# Altium project ME507_STM32_PCB.PrjPcb
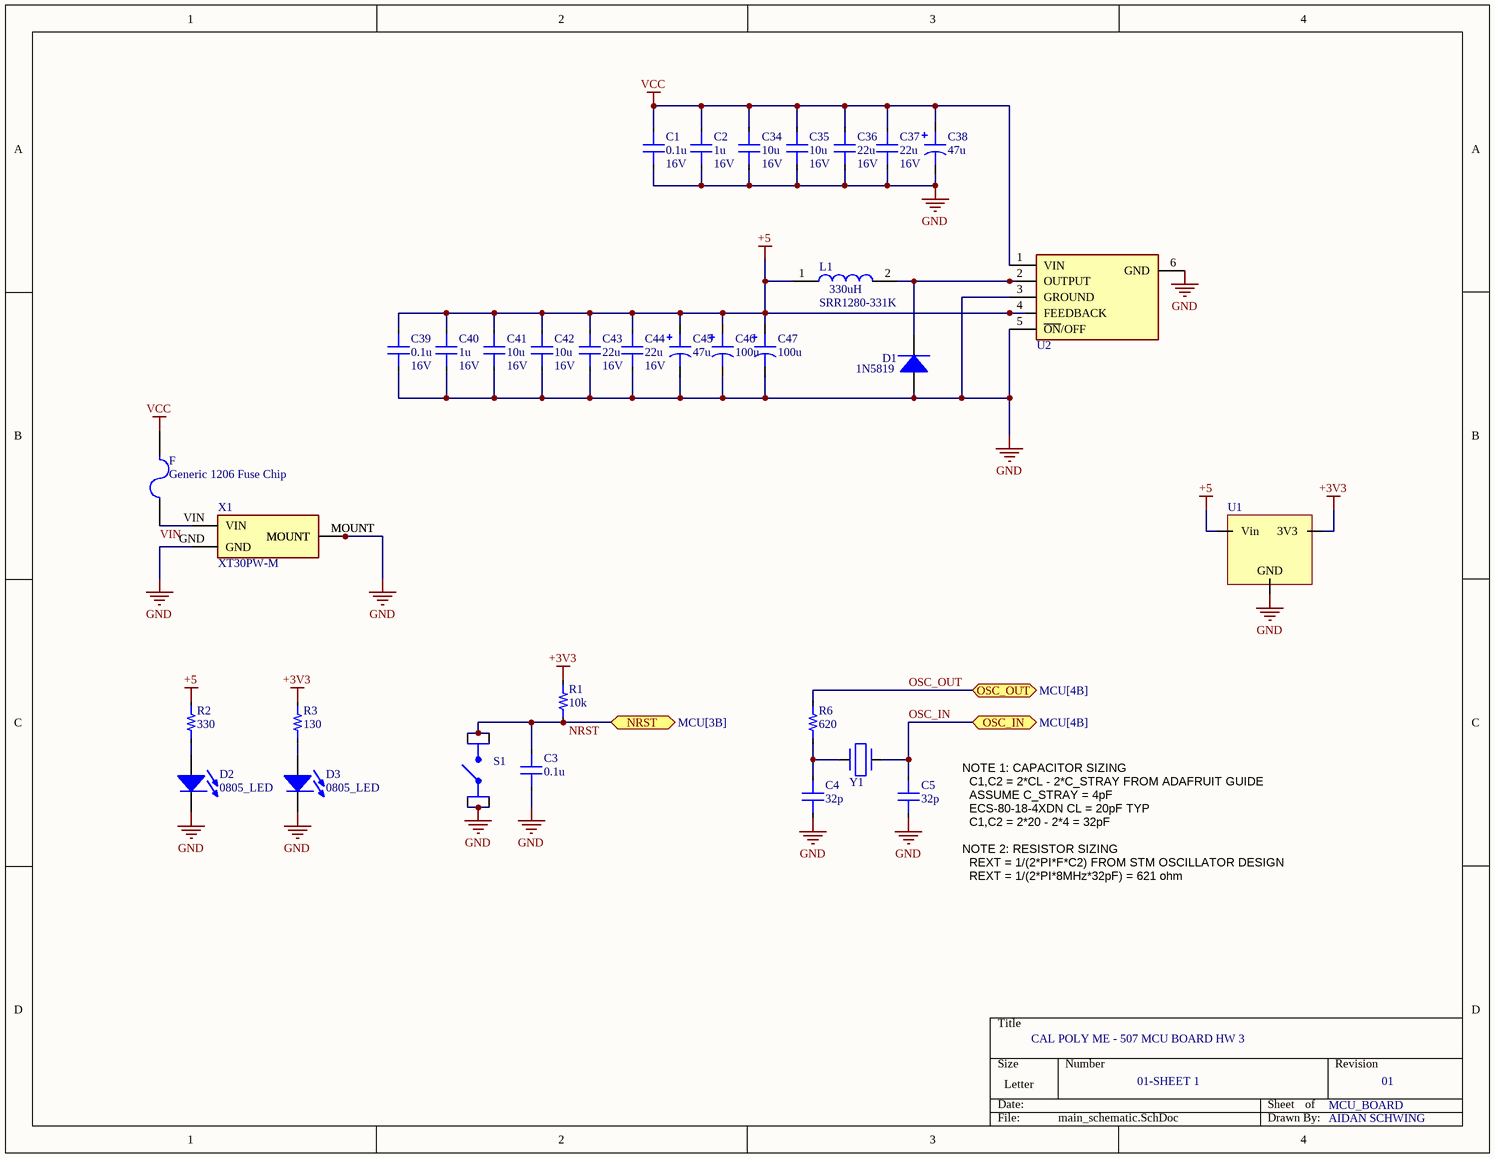
[diagram p0: main_schematic.SchDoc]
2 sheets, 73 parts. Net scope: flat (ports and power ports of the same name join across sheets).
Board file: MCU_v2.PcbDoc
Sheets:
  main_schematic.SchDoc
  MCU.SchDoc

## Sheet main_schematic.SchDoc
size Letter; DrawnBy: AIDAN SCHWING; SheetNumber: 1; SheetTotal: 2

### Parts
C1  value 0.1u  Voltage: 16V  [0603_CAP]  (hidden comment: Capacitor)
C2  value 1u  Voltage: 16V  [0603_CAP]  (hidden comment: Capacitor)
C3  value 0.1u  [0805_CAP]  (hidden comment: Capacitor)
C4  value 32p  [0805_CAP]  (hidden comment: Capacitor)
C5  value 32p  [0805_CAP]  (hidden comment: Capacitor)
C34  value 10u  Voltage: 16V  [0805_CAP]  (hidden comment: Capacitor)
C35  value 10u  Voltage: 16V  [0805_CAP]  (hidden comment: Capacitor)
C36  value 22u  Voltage: 16V  [1210_CAP]  (hidden comment: Capacitor)
C37  value 22u  Voltage: 16V  [1210_CAP]  (hidden comment: Capacitor)
C38  value 47u  [6.60x6.60x8.00mm_E_CAP]  (hidden comment: UWT1H470MCL1GS)
C39  value 0.1u  Voltage: 16V  [0603_CAP]  (hidden comment: Capacitor)
C40  value 1u  Voltage: 16V  [0603_CAP]  (hidden comment: Capacitor)
C41  value 10u  Voltage: 16V  [0805_CAP]  (hidden comment: Capacitor)
C42  value 10u  Voltage: 16V  [0805_CAP]  (hidden comment: Capacitor)
C43  value 22u  Voltage: 16V  [1210_CAP]  (hidden comment: Capacitor)
C44  value 22u  Voltage: 16V  [1210_CAP]  (hidden comment: Capacitor)
C45  value 47u  [6.60x6.60x8.00mm_E_CAP]  (hidden comment: UWT1H470MCL1GS)
C46  value 100u  [6.60x6.60x8.00mm_E_CAP]  (hidden comment: 865080343009)
C47  value 100u  [6.60x6.60x8.00mm_E_CAP]  (hidden comment: 865080343009)
D1  1N5819  [SOD-123F]
D2  0805_LED  [0805_LED]
D3  0805_LED  [0805_LED]
F  Generic 1206 Fuse Chip  [1206_RES]
L1  SRR1280-331K  [SRR1280-150M]
R1  value 10k  [0603_RES]  (hidden comment: Resistor)
R2  value 330  [0603_RES]  (hidden comment: Resistor)
R3  value 130  [0603_RES]  (hidden comment: Resistor)
R6  value 620  [0805_RES]  (hidden comment: Resistor)
S1  TactileSwitch  [6mmTactileSwitch_ThroughHole]  (value not drawn)
U1  (no value)  [DPAK3_TO-252-3]
U2  LM2576-5.0WU  [MICROCHIP_TO-263]  (value not drawn)
X1  XT30PW-M  [XT30PWM]
Y1  ECS-80-18-4XDN  [ECS-80-18]  (value not drawn)

### Ports
NRST (bidir, see MCU[3B]), OSC_IN (bidir, see MCU[4B]), OSC_OUT (bidir, see MCU[4B])

### Nets
+3V3: R1.2 R3.2 U1.4(3V3)
+5: C39.1 C40.1 C41.1 C42.1 C43.1 C44.1 C45.1 C46.1 C47.1 L1.1 R2.2 U1.3(Vin) U2.4(FEEDBACK)
GND: C1.2 C2.2 C3.1 C4.1 C5.1 C34.2 C35.2 C36.2 C37.2 C38.2 C39.2 C40.2 C41.2 C42.2 C43.2 C44.2 C45.2 C46.2 C47.2 D1.2 D2.2(K) D3.2(K) S1.1 S1.2 U1.1(GND) U2.3(GROUND) U2.5(~{ON}/OFF) U2.6(GND) X1.GND X1.MOUNT
VCC: C1.1 C2.1 C34.1 C35.1 C36.1 C37.1 C38.1 F.2 U2.1(VIN)
NRST: C3.2 R1.1 S1.3 S1.4 ; port NRST
OSC_IN: C5.2 Y1.2 ; port OSC_IN
OSC_OUT: R6.2 ; port OSC_OUT
VIN: F.1 X1.VIN
NetC4_2: C4.2 R6.1 Y1.1
NetD1_1: D1.1 L1.2 U2.2(OUTPUT)
NetD2_1: D2.1(A) R2.1
NetD3_1: D3.1(A) R3.1

### Notes on the sheet
- (near C5) NOTE 1: CAPACITOR SIZING
  C1,C2 = 2*CL - 2*C_STRAY FROM ADAFRUIT GUIDE
  ASSUME C_STRAY = 4pF
  ECS-80-18-4XDN CL = 20pF TYP
  C1,C2 = 2*20 - 2*4 = 32pF
  NOTE 2: RESISTOR SIZING
  REXT = 1/(2*PI*F*C2) FROM STM OSCILLATOR DESIGN
  REXT = 1/(2*PI*8MHz*32pF) = 621 ohm
- CAL POLY ME - 507 MCU BOARD HW 3
- 01-SHEET 1
- MCU_BOARD
- 01
- AIDAN SCHWING

### Library data of the parts
C38 C45 = UWT1H470MCL1GS: Percent Tolerance: 20; Dielectric: *; ESR: *; ComponentLink1Description: Digikey; ComponentLink1URL: https://www.digikey.com/product-detail/en/nichicon/UWT1H470MCL1GS/493-2225-1-ND/590200
C46 C47 = 865080343009: CAP ALUM 100UF 20% 16V SMD; Percent Tolerance: 20; Dielectric: *; ESR: *; ComponentLink1Description: Digikey; ComponentLink1URL: https://www.digikey.com/en/products/detail/w%C3%BCrth-elektronik/865080343009/5728014
D1 = 1N5819: Diode Super Barrier 40V 1A Surface Mount SOD-123F; Num_Circuits: 1; Vr: 40V; Package: SOD-123F; ComponentLink1Description: Digikey; ComponentLink1URL: https://www.digikey.com/product-detail/en/diodes-incorporated/1N5819HW1-7-F/1N5819HW1-7-FDITR-ND/5768523
D2 D3 = 0805_LED: Generic 0805 LED
L1 = SRR1280-331K: Power Inductors - SMD 330uH 10% SMD 1280; MfrPartNo: 652-SRR1280-331K; iMax: 1.1A; Resistance: 600mOhm; Link: https://www.mouser.com/ProductDetail/Bourns/SRR1280-331K?qs=brMhP%2FMjUfd0KI3Wq6D0xQ%3D%3D; Name: SRR1280-331K; Package: 5050; Inductance: 330uH
S1 = TactileSwitch: Generic 6mm Through Hole Tactile Switch; Current: 0.05A; MaxVoltage: 12V; Pole: 1; Name: TactileSwitch; Mounting: TH; ComponentLink1Description: Digikey; ComponentLink1URL: https://www.digikey.com/en/products/detail/c-k/PTS645SH95-2-LFS/1146763
U1 = NCP1117DT33T5G: IC REG LINEAR 3.3V 1A DPAK
U2 = LM2576-5.0WU: Switching Voltage Regulators 3A Step-Down SMPS Regulator; Manufacturer_Name: Microchip; Datasheet Link: http://ww1.microchip.com/downloads/en/DeviceDoc/lm2576.pdf; Manufacturer_Part_Number: LM2576-5.0WU; Mouser Part Number: 998-LM2576-5.0WU; Mouser Price/Stock: https://www.mouser.co.uk/ProductDetail/Microchip-Technology/LM2576-5.0WU?qs=kh6iOki%2FeLHlI9xhWDTjJw%3D%3D; Arrow Part Number: LM2576-5.0WU; Arrow Price/Stock: https://www.arrow.com/en/products/lm2576-5.0wu/microchip-technology?region=nac
X1 = XT30PW-M: Socket; DC supply; XT30; male; PIN: 2; on PCBs; THT; yellow; 15A; 500V; Manufacturer_Name: Amass; Datasheet Link: https://www.tme.eu/sl/Document/ce4077e36b79046da520ca73227e15de/XT30PW%20SPEC.pdf; Height: 5mm; Manufacturer_Part_Number: XT30PW-M
Y1 = ECS-80-18-4XDN: Crystals 8MHz 18pF EX/TEMP HC-49US; ComponentLink1Description: Mouser; ComponentLink1URL: https://www.mouser.com/ProductDetail/ECS/ECS-80-18-4XDN?qs=CkbNAJEAr%2FRohZNNeAgxsQ%3D%3D
C1-C5 C34-C37 C39-C44 = Capacitor: Dielectric: *; Percent Tolerance: *; ESR: *
R1-R3 R6 = Resistor: Tolerance: *

## Sheet MCU.SchDoc
size Tabloid; SheetNumber: 2; SheetTotal: 2
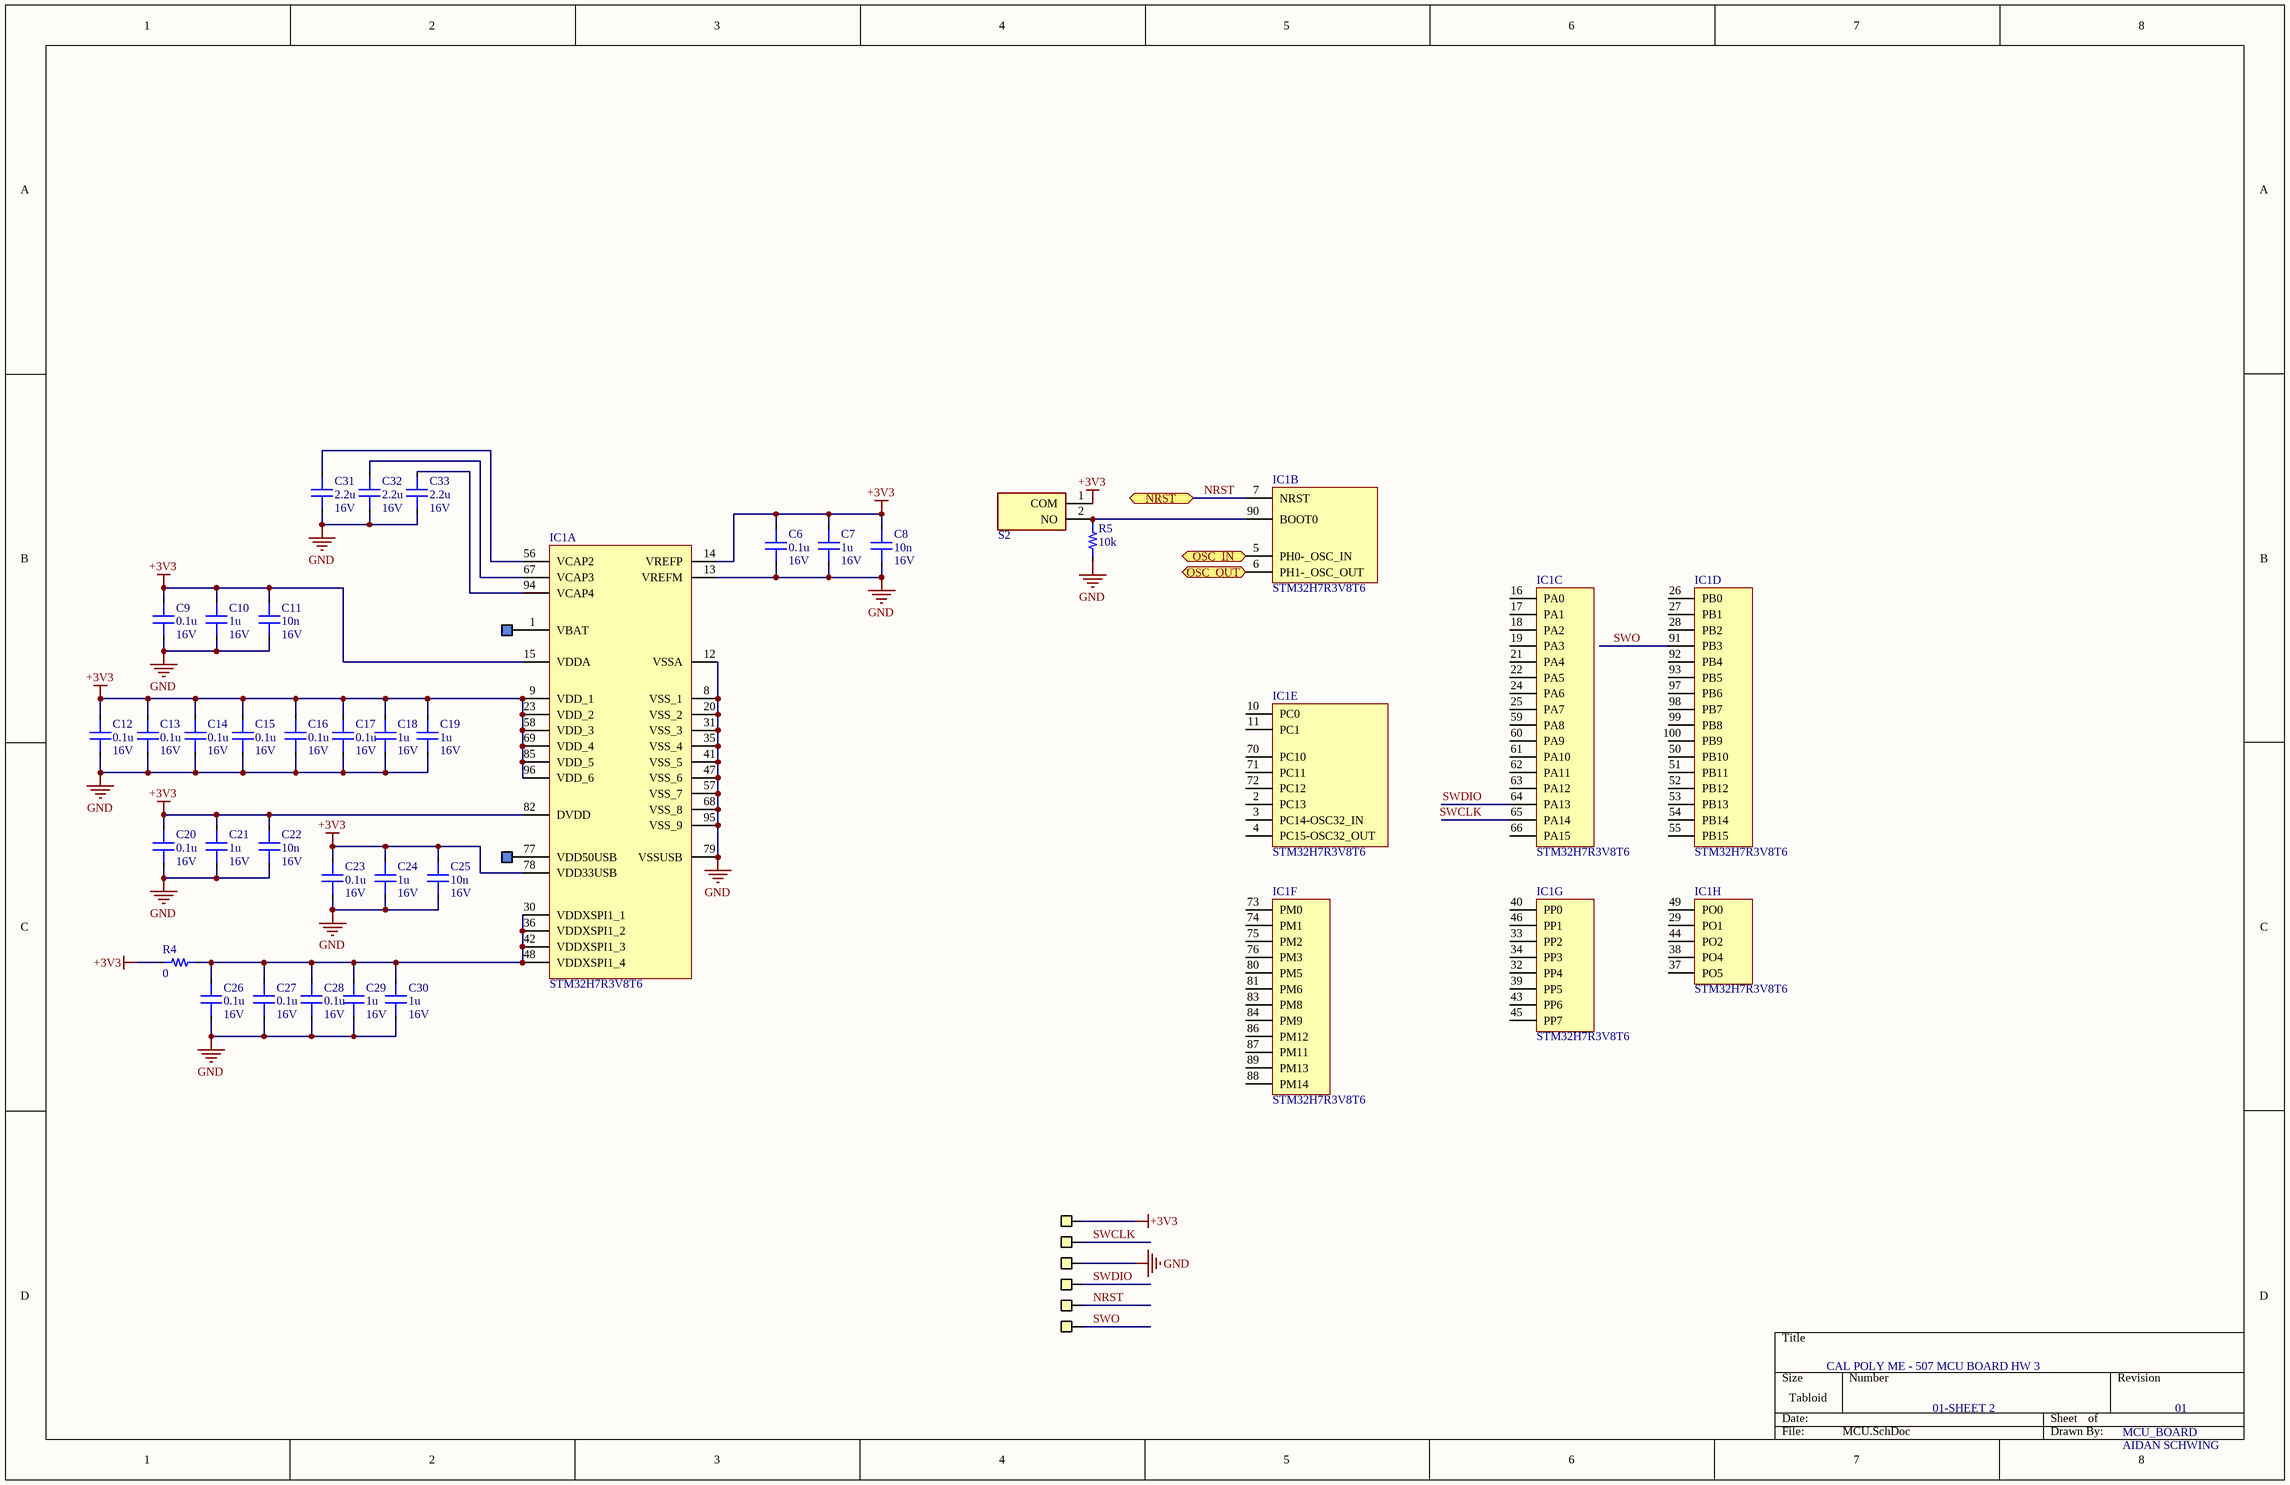
[diagram p1: MCU.SchDoc]

### Parts
C6  value 0.1u  Voltage: 16V  [0603_CAP]  (hidden comment: Capacitor)
C7  value 1u  Voltage: 16V  [0603_CAP]  (hidden comment: Capacitor)
C8  value 10n  Voltage: 16V  [0603_CAP]  (hidden comment: Capacitor)
C9  value 0.1u  Voltage: 16V  [0603_CAP]  (hidden comment: Capacitor)
C10  value 1u  Voltage: 16V  [0603_CAP]  (hidden comment: Capacitor)
C11  value 10n  Voltage: 16V  [0603_CAP]  (hidden comment: Capacitor)
C12  value 0.1u  Voltage: 16V  [0603_CAP]  (hidden comment: Capacitor)
C13  value 0.1u  Voltage: 16V  [0603_CAP]  (hidden comment: Capacitor)
C14  value 0.1u  Voltage: 16V  [0603_CAP]  (hidden comment: Capacitor)
C15  value 0.1u  Voltage: 16V  [0603_CAP]  (hidden comment: Capacitor)
C16  value 0.1u  Voltage: 16V  [0603_CAP]  (hidden comment: Capacitor)
C17  value 0.1u  Voltage: 16V  [0603_CAP]  (hidden comment: Capacitor)
C18  value 1u  Voltage: 16V  [0603_CAP]  (hidden comment: Capacitor)
C19  value 1u  Voltage: 16V  [0603_CAP]  (hidden comment: Capacitor)
C20  value 0.1u  Voltage: 16V  [0603_CAP]  (hidden comment: Capacitor)
C21  value 1u  Voltage: 16V  [0603_CAP]  (hidden comment: Capacitor)
C22  value 10n  Voltage: 16V  [0603_CAP]  (hidden comment: Capacitor)
C23  value 0.1u  Voltage: 16V  [0603_CAP]  (hidden comment: Capacitor)
C24  value 1u  Voltage: 16V  [0603_CAP]  (hidden comment: Capacitor)
C25  value 10n  Voltage: 16V  [0603_CAP]  (hidden comment: Capacitor)
C26  value 0.1u  Voltage: 16V  [0603_CAP]  (hidden comment: Capacitor)
C27  value 0.1u  Voltage: 16V  [0603_CAP]  (hidden comment: Capacitor)
C28  value 0.1u  Voltage: 16V  [0603_CAP]  (hidden comment: Capacitor)
C29  value 1u  Voltage: 16V  [0603_CAP]  (hidden comment: Capacitor)
C30  value 1u  Voltage: 16V  [0603_CAP]  (hidden comment: Capacitor)
C31  value 2.2u  Voltage: 16V  [0603_CAP]  (hidden comment: Capacitor)
C32  value 2.2u  Voltage: 16V  [0603_CAP]  (hidden comment: Capacitor)
C33  value 2.2u  Voltage: 16V  [0603_CAP]  (hidden comment: Capacitor)
IC1  STM32H7R3V8T6  [QFP50P1600X1600X160-100N]  (parts A,B,C,D,E,F,G,H of 8)
R4  value 0  [0805_RES]  (hidden comment: Resistor)
R5  value 10k  [0603_RES]  (hidden comment: Resistor)
S2  DS04-254-2-01BK-SMT-TR  [DS04254201BKSMTTR]  (value not drawn)
X2  HeaderPad  [HeaderPad]  (value not drawn)
X3  HeaderPad  [HeaderPad]  (value not drawn)
X4  GenericPinHeader(0.1in)  [GenericPinHeader(.1in)]  (value not drawn)
X5  GenericPinHeader(0.1in)  [GenericPinHeader(.1in)]  (value not drawn)
X6  GenericPinHeader(0.1in)  [GenericPinHeader(.1in)]  (value not drawn)
X7  GenericPinHeader(0.1in)  [GenericPinHeader(.1in)]  (value not drawn)
X8  GenericPinHeader(0.1in)  [GenericPinHeader(.1in)]  (value not drawn)
X9  GenericPinHeader(0.1in)  [GenericPinHeader(.1in)]  (value not drawn)

### Ports
NRST (bidir, see main_schematic[2C]), OSC_IN (bidir, see main_schematic[3C]), OSC_OUT (bidir, see main_schematic[3C])

### Nets
+3V3: C6.2 C7.2 C8.2 C9.2 C10.2 C11.2 C12.2 C13.2 C14.2 C15.2 C16.2 C17.2 C18.2 C19.2 C20.2 C21.2 C22.2 C23.2 C24.2 C25.2 IC1.9(VDD_1) IC1.14(VREFP) IC1.15(VDDA) IC1.23(VDD_2) IC1.58(VDD_3) IC1.69(VDD_4) IC1.78(VDD33USB) IC1.82(DVDD) IC1.85(VDD_5) IC1.96(VDD_6) R4.1 S2.1(COM) X4.1(Pin)
GND: C6.1 C7.1 C8.1 C9.1 C10.1 C11.1 C12.1 C13.1 C14.1 C15.1 C16.1 C17.1 C18.1 C19.1 C20.1 C21.1 C22.1 C23.1 C24.1 C25.1 C26.1 C27.1 C28.1 C29.1 C30.1 C31.1 C32.1 C33.1 IC1.8(VSS_1) IC1.12(VSSA) IC1.13(VREFM) IC1.20(VSS_2) IC1.31(VSS_3) IC1.35(VSS_4) IC1.41(VSS_5) IC1.47(VSS_6) IC1.57(VSS_7) IC1.68(VSS_8) IC1.79(VSSUSB) IC1.95(VSS_9) R5.1 X6.1(Pin)
NRST: IC1.7(NRST) X8.1(Pin) ; port NRST
OSC_IN: IC1.5(PH0-_OSC_IN) ; port OSC_IN
OSC_OUT: IC1.6(PH1-_OSC_OUT) ; port OSC_OUT
SWCLK: IC1.65(PA14) X5.1(Pin)
SWDIO: IC1.64(PA13) X7.1(Pin)
SWO: IC1.91(PB3) X9.1(Pin)
NetC26_2: C26.2 C27.2 C28.2 C29.2 C30.2 IC1.30(VDDXSPI1_1) IC1.36(VDDXSPI1_2) IC1.42(VDDXSPI1_3) IC1.48(VDDXSPI1_4) R4.2
NetC31_2: C31.2 IC1.56(VCAP2)
NetC32_2: C32.2 IC1.67(VCAP3)
NetC33_2: C33.2 IC1.94(VCAP4)
NetIC1_1: IC1.1(VBAT) X2.1(Pin)
NetIC1_77: IC1.77(VDD50USB) X3.1(Pin)
NetIC1_90: IC1.90(BOOT0) R5.2 S2.2(NO)

Not connected (* = marked no-connect by the designer): IC1 2(PC13) 3(PC14-OSC32_IN) 4(PC15-OSC32_OUT) 10(PC0) 11(PC1) 16(PA0) 17(PA1) 18(PA2) 19(PA3) 21(PA4) 22(PA5) 24(PA6) 25(PA7) 26(PB0) 27(PB1) 28(PB2) 29(PO1) 32(PP4) 33(PP2) 34(PP3) 37(PO5) 38(PO4) 39(PP5) 40(PP0) 43(PP6) 44(PO2) 45(PP7) 46(PP1) 49(PO0) 50(PB10) 51(PB11) 52(PB12) 53(PB13) 54(PB14) 55(PB15) 59(PA8) 60(PA9) 61(PA10) 62(PA11) 63(PA12) 66(PA15) 70(PC10) 71(PC11) 72(PC12) 73(PM0) 74(PM1) 75(PM2) 76(PM3) 80(PM5) 81(PM6) 83(PM8) 84(PM9) 86(PM12) 87(PM11) 88(PM14) 89(PM13) 92(PB4) 93(PB5) 97(PB6) 98(PB7) 99(PB8) 100(PB9)

### Notes on the sheet
- CAL POLY ME - 507 MCU BOARD HW 3
- 01-SHEET 2
- MCU_BOARD
- 01
- AIDAN SCHWING

### Library data of the parts
IC1 = STM32H7R3V8T6: IC MCU 32BIT 64KB FLASH 100LQFP; Manufacturer_Name: STMicroelectronics; Datasheet Link: https://www.st.com/resource/en/datasheet/stm32h7r3a8.pdf; Height: 1.6mm; Manufacturer_Part_Number: STM32H7R3V8T6
S2 = DS04-254-2-01BK-SMT-TR: DIP Switches / SIP Switches DIP Switch, SPST, 2.54 pitch, flat actuator, SMT, Tape and reel, 1 position, Black; Manufacturer_Name: CUI Devices; Datasheet Link: https://www.cuidevices.com/product/resource/supplyframepdf/ds04-254-smt.pdf; Height: 4.3mm; Manufacturer_Part_Number: DS04-254-2-01BK-SMT-TR; Mouser Part Number: 490-DS04254201BK-STR; Mouser Price/Stock: https://www.mouser.co.uk/ProductDetail/CUI-Devices/DS04-254-2-01BK-SMT-TR?qs=wnTfsH77Xs4xXRFXKF0ssg%3D%3D; Arrow Part Number: DS04-254-2-01BK-SMT-TR; Arrow Price/Stock: https://www.arrow.com/en/products/ds04-254-2-01bk-smt-tr/cui-devices?region=nac
X2 X3 = HeaderPad: Pad for pin header
X4-X9 = GenericPinHeader(0.1in): Generic .1in(2.54mm) pitch pin header
C6-C33 = Capacitor: Dielectric: *; Percent Tolerance: *; ESR: *
R4 R5 = Resistor: Tolerance: *

## Nets that join several sheets
+3V3: main_schematic (R1.2 R3.2 U1.4), MCU (33 pins)
GND: main_schematic (30 pins), MCU (42 pins)
NRST: main_schematic (C3.2 R1.1 S1.3 S1.4), MCU (IC1.7 X8.1)
OSC_IN: main_schematic (C5.2 Y1.2), MCU (IC1.5)
OSC_OUT: main_schematic (R6.2), MCU (IC1.6)